# EAGLE design 5-keys (EAGLE 9.6.2)
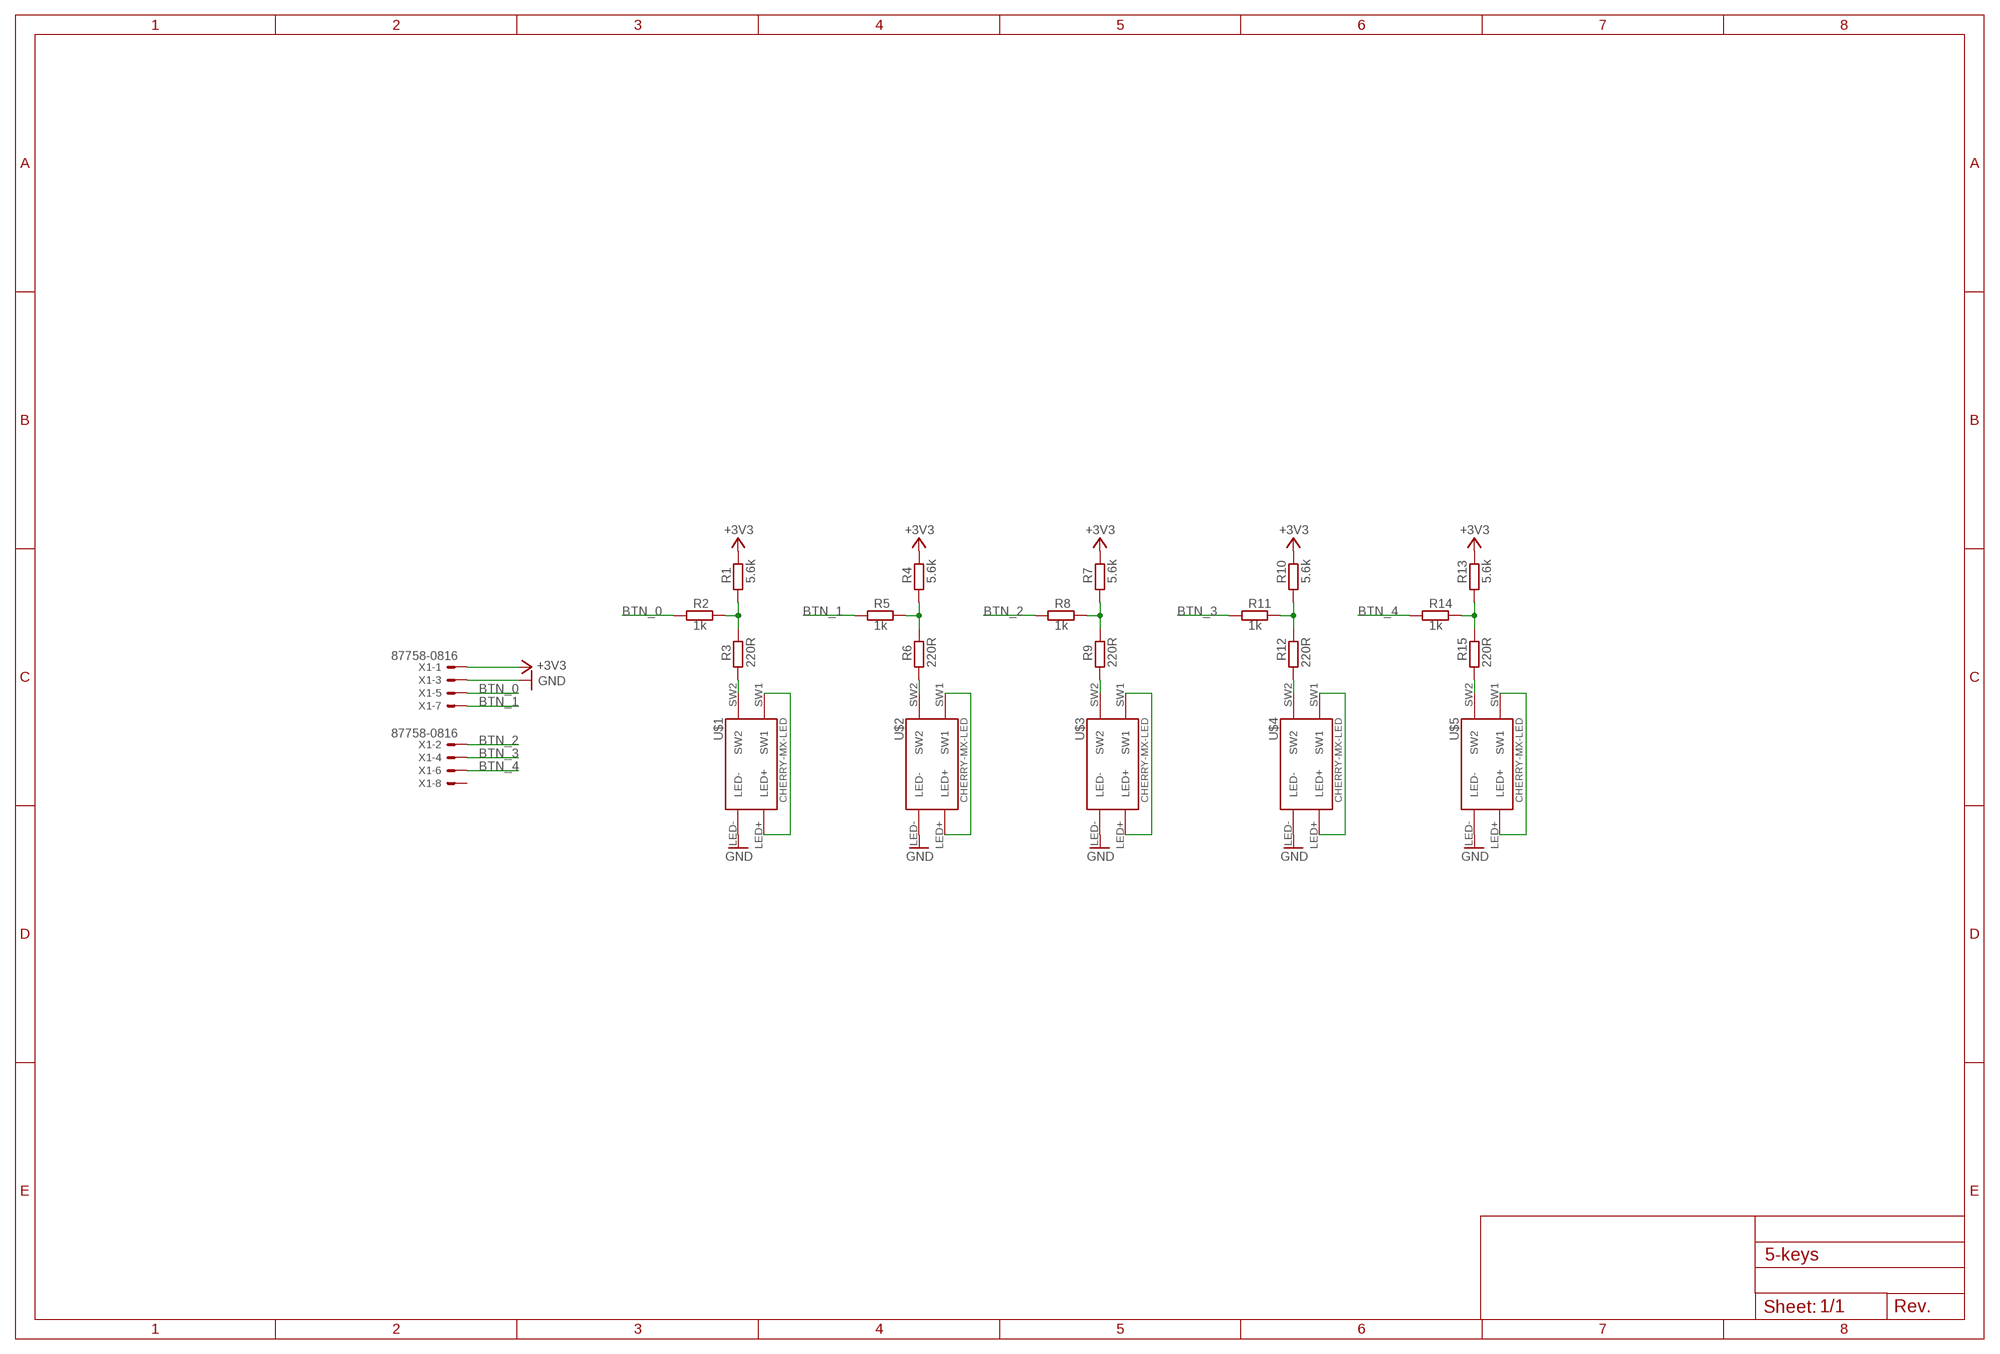
[diagram p0: schematic, sheet 1]

## Parts
R1  5.6k  RESISTOR  [R0603]
R2  1k  RESISTOR  [R0603]
R3  220R  RESISTOR  [R0603]
R4  5.6k  RESISTOR  [R0603]
R5  1k  RESISTOR  [R0603]
R6  220R  RESISTOR  [R0603]
R7  5.6k  RESISTOR  [R0603]
R8  1k  RESISTOR  [R0603]
R9  220R  RESISTOR  [R0603]
R10  5.6k  RESISTOR  [R0603]
R11  1k  RESISTOR  [R0603]
R12  220R  RESISTOR  [R0603]
R13  5.6k  RESISTOR  [R0603]
R14  1k  RESISTOR  [R0603]
R15  220R  RESISTOR  [R0603]
U$1  CHERRY-MX-LED  [CHERRY-MX-LED]
U$2  CHERRY-MX-LED  [CHERRY-MX-LED]
U$3  CHERRY-MX-LED  [CHERRY-MX-LED]
U$4  CHERRY-MX-LED  [CHERRY-MX-LED]
U$5  CHERRY-MX-LED  [CHERRY-MX-LED]
X1  87758-0816  [87758-0816]

## Nets
+3V3: R1.2 R4.2 R7.2 R10.2 R13.2 X1.1
BTN_0: R2.1 X1.5
BTN_1: R5.1 X1.7
BTN_2: R8.1 X1.2
BTN_3: R11.1 X1.4
BTN_4: R14.1 X1.6
GND: U$1.LED- U$2.LED- U$3.LED- U$4.LED- U$5.LED- X1.3
N$1: R1.1 R2.2 R3.2
N$2: R3.1 U$1.SW2
N$3: U$1.LED+ U$1.SW1
N$4: R4.1 R5.2 R6.2
N$5: R6.1 U$2.SW2
N$6: U$2.LED+ U$2.SW1
N$7: R7.1 R8.2 R9.2
N$8: R9.1 U$3.SW2
N$9: U$3.LED+ U$3.SW1
N$10: R10.1 R11.2 R12.2
N$11: R12.1 U$4.SW2
N$12: U$4.LED+ U$4.SW1
N$13: R13.1 R14.2 R15.2
N$14: R15.1 U$5.SW2
N$15: U$5.LED+ U$5.SW1
Unconnected: X1.8

## Library data of the parts
R1-R15 = lib:RESISTOR
U$1-U$5 = cherrymx:CHERRY-MX-LED: Cherry MX series keyswitch with LED
X1 = lib:87758-0816: 8 Pin - 2mm Dual Row Single Wafer, Vertical T/H HDR Source: http://www.molex.com/pdm_docs/sd/877580616_sd.pdf; MF: MOLEX; MPN: 87758-0816; OC_FARNELL: 7472331; OC_NEWARK: 59J1556

## Board
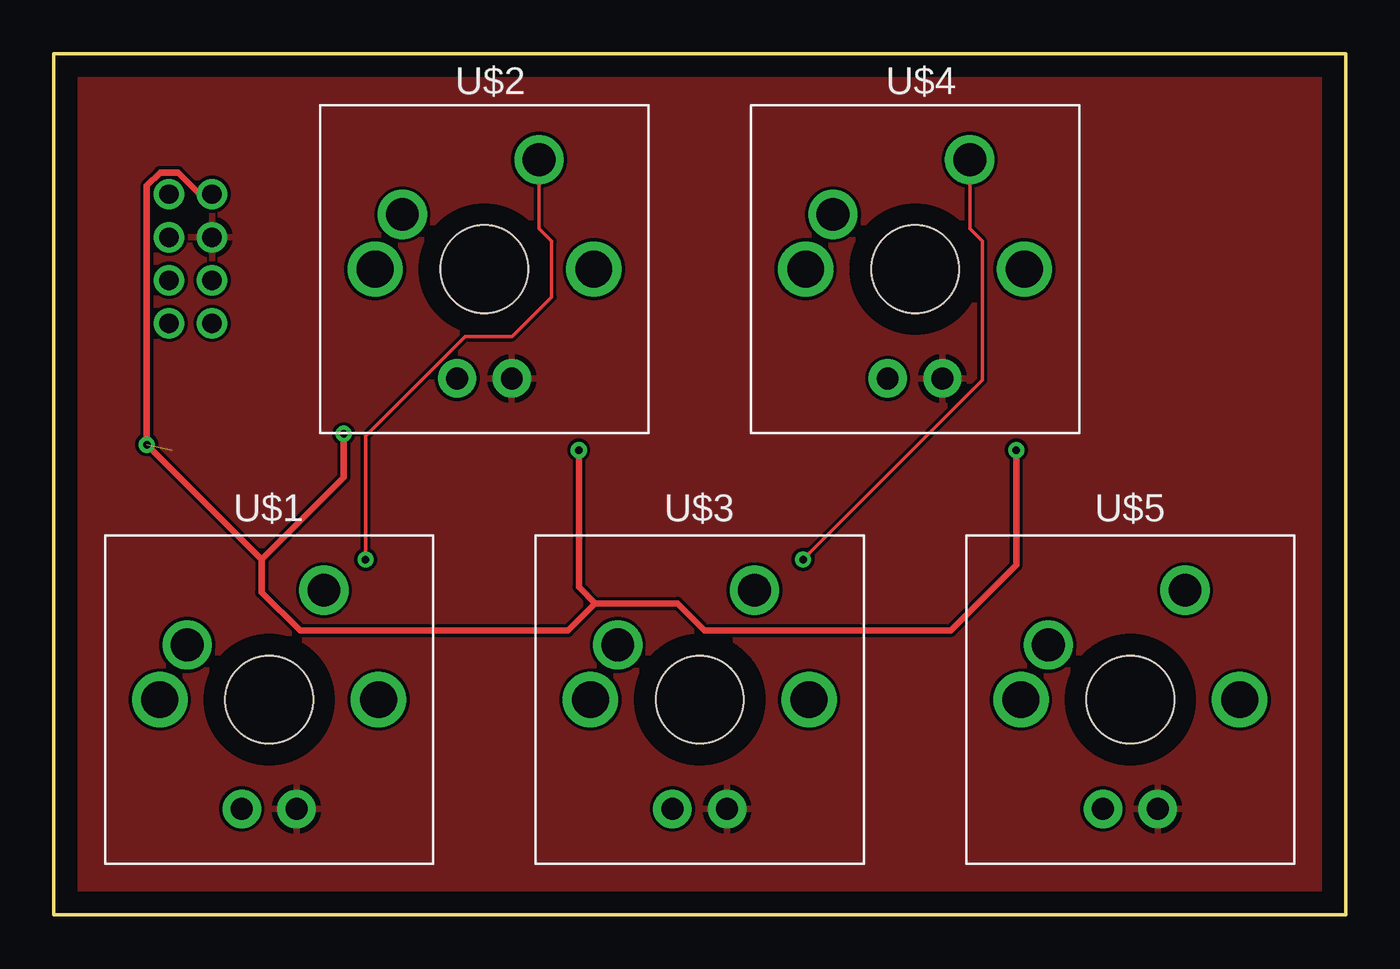
[diagram p1: board, top side]
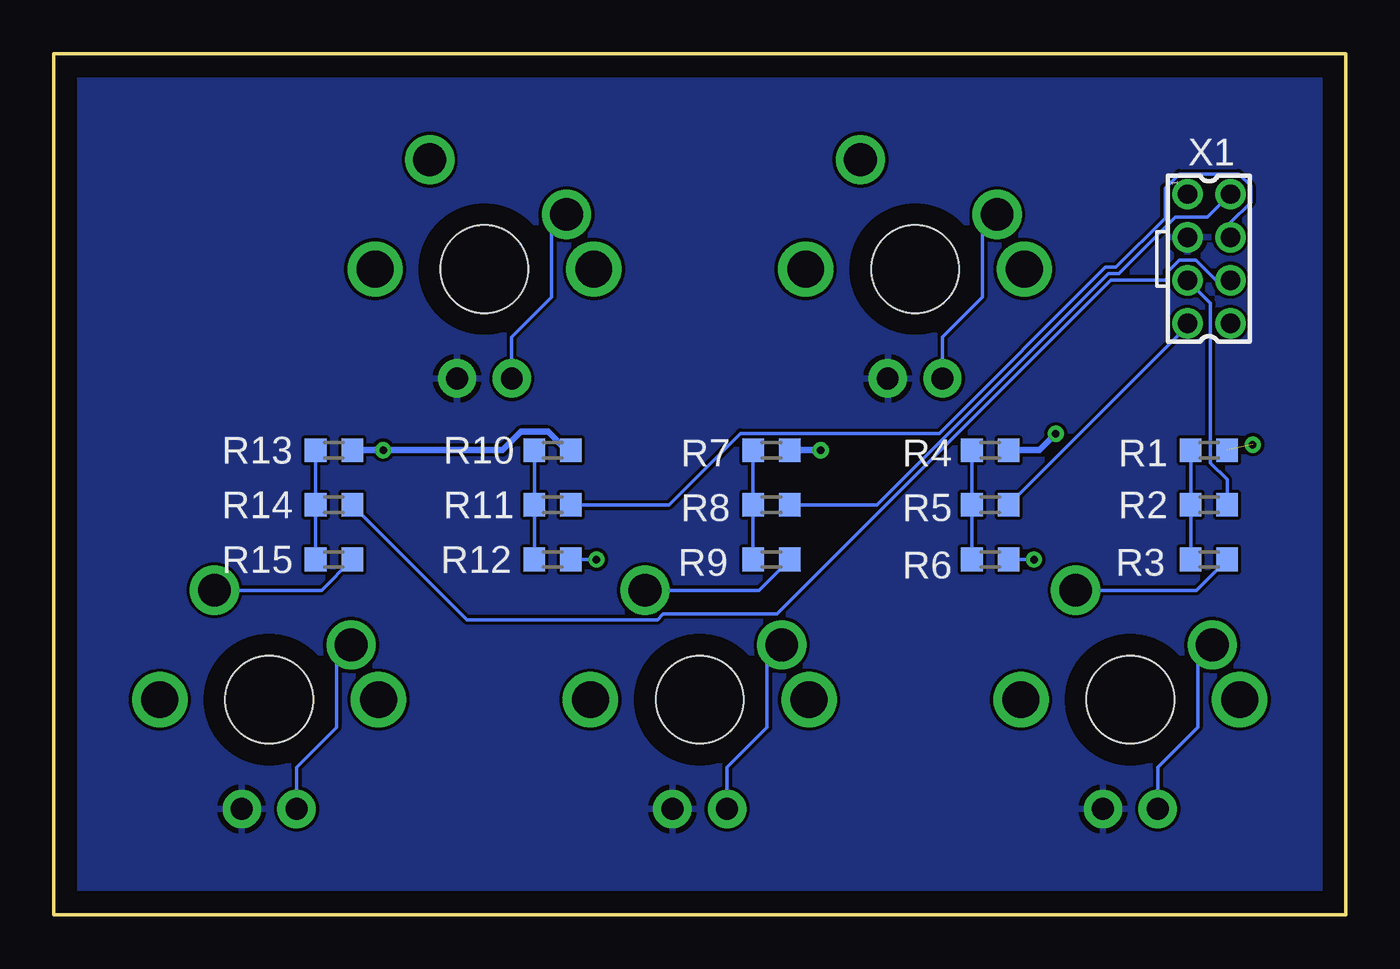
[diagram p2: board, bottom side, seen from below]

Size 60 x 40 mm. Coordinates in mm from the lower left corner, seen from the top.
Outline: 0,0 60,0 60,40 0,40 0,0
Copper layers (1*16): Top 0.035mm / dielectric 1.5mm / Bottom 0.035mm
Design rules "default": minimum track width 6mil, minimum drill 0.35mm, track to track 6mil, track to pad 6mil, pad to pad 6mil, via to via 6mil, smd to smd 6mil, copper to edge 40mil, drill to drill 6mil, minimum pad ring 10mil, minimum via ring 8mil, stop-mask expansion 4mil, vias tented up to drill 0mil, thermal gap 10mil

### Footprints (pad centres in the part's own frame; a part is rotated, then mirrored left to right if it is on the bottom)
R0603 = smd 1 x 1.1: 1 -0.85,0; 2 0.85,0
CHERRY-MX-LED = drill 1.016 pad 1.778: LED+ -1.27,-5.08; LED- 1.27,-5.08 | drill 1.714 pad 1.93: P$3 -5.08,0; P$4 5.08,0 | drill 1.524 pad 2.286: SW1 -3.81,2.54; SW2 2.54,5.08 | hole 4.064: 0,0
87758-0816 = drill 0.9 pad 1.27: 1 -3,-1; 2 -3,1; 3 -1,-1; 4 -1,1; 5 1,-1; 6 1,1; 7 3,-1; 8 3,1

### Placement (x,y rotation side)
R1  6.35,21.59 0 bottom
R2  6.35,19.05 180 bottom
R3  6.35,16.51 180 bottom
R4  16.51,21.59 0 bottom
R5  16.51,19.05 180 bottom
R6  16.51,16.51 180 bottom
R7  26.67,21.59 0 bottom
R8  26.67,19.05 180 bottom
R9  26.67,16.51 180 bottom
R10  36.83,21.59 0 bottom
R11  36.83,19.05 180 bottom
R12  36.83,16.51 180 bottom
R13  46.99,21.59 0 bottom
R14  46.99,19.05 180 bottom
R15  46.99,16.51 180 bottom
U$1  10,10 0 top
U$2  20,30 0 top
U$3  30,10 0 top
U$4  40,30 0 top
U$5  50,10 0 top
X1  6.35,30.48 270 bottom

### Tracks (layer width: path | path; a pad name or v marks a point on that pad's centre or on a via)
+3V3  (via drill 0.35)  (1 unrouted)
  Top 0.305: X1.1 6.78,33.48 5.77,34.49 4.93,34.49 4.32,33.88 v4.32,21.84 9.65,16.51 | 9.65,16.51 9.65,14.99 11.43,13.21 23.88,13.21 25.15,14.48 | 25.15,14.48 28.96,14.48 30.23,13.21 41.66,13.21 44.7,16.26 v44.7,21.59 | v13.46,22.35 13.46,20.32 9.65,16.51 | v24.38,21.59 24.38,15.24 25.15,14.48
  Bottom 0.305: R13.2 v44.7,21.59 39.16,21.59 38.31,22.45 37.05,22.45 36.2,21.59 R10.2 | R4.2 14.22,21.59 v13.46,22.35 | R7.2 v24.38,21.59
BTN_0
  Bottom 0.152: R2.1 5.5,20.22 6.28,21 6.28,28.41 X1.5
BTN_1
  Bottom 0.152: R5.1 7.35,27.36 X1.7
BTN_2
  Bottom 0.152: X1.2 6.42,32.41 7.91,32.41 10.54,29.79 11.03,29.79 21.77,19.05 R8.1
BTN_3
  Bottom 0.152: R11.1 31.43,19.05 28.11,22.37 18.88,22.37 11.16,30.09 10.66,30.09 8.38,32.37 8.38,33.77 7.74,34.41 4.96,34.41 4.42,33.87 4.42,33.09 5.35,32.16 X1.4
BTN_4
  Bottom 0.152: X1.6 6.03,29.48 6.96,30.41 7.74,30.41 8.28,29.87 8.28,29.48 10.91,29.48 26.42,13.97 31.71,13.97 31.97,13.71 40.8,13.71 R14.1
GND
  pour Top: 0,39.88 59.94,39.88 59.94,0 0,0
  pour Bottom: 0,39.88 59.94,39.88 59.94,0 0,0
N$1
  Bottom 0.152: R3.2 R2.2 R1.1
N$2
  Bottom 0.152: R3.1 6.93,15.08 U$1.SW2
N$3
  Bottom 0.152: U$1.SW1 6.88,11.85 6.88,8.71 8.73,6.85 U$1.LED+
N$4
  Bottom 0.152: R4.1 R5.2 R6.2
N$5  (via drill 0.35)
  Top 0.152: U$2.SW2 22.54,31.88 23.12,31.29 23.12,28.71 21.29,26.88 19.11,26.88 14.48,22.25 v14.48,16.51
  Bottom 0.152: R6.1 v14.48,16.51
N$6
  Bottom 0.152: U$2.SW1 16.88,31.85 16.88,28.71 18.73,26.85 U$2.LED+
N$7
  Bottom 0.152: R9.2 R8.2 R7.1
N$8
  Bottom 0.152: R9.1 27.25,15.08 U$3.SW2
N$9
  Bottom 0.152: U$3.SW1 26.88,11.85 26.88,8.71 28.73,6.85 U$3.LED+
N$10
  Bottom 0.152: R10.1 R11.2 R12.2
N$11  (via drill 0.35)
  Top 0.152: U$4.SW2 42.54,31.88 43.12,31.29 43.12,24.84 v34.8,16.51
  Bottom 0.152: R12.1 v34.8,16.51
N$12
  Bottom 0.152: U$4.SW1 36.88,31.85 36.88,28.71 38.73,26.85 U$4.LED+
N$13
  Bottom 0.152: R15.2 R14.2 R13.1
N$14
  Bottom 0.152: R15.1 47.57,15.08 U$5.SW2
N$15
  Bottom 0.152: U$5.SW1 46.88,11.85 46.88,8.71 48.73,6.85 U$5.LED+